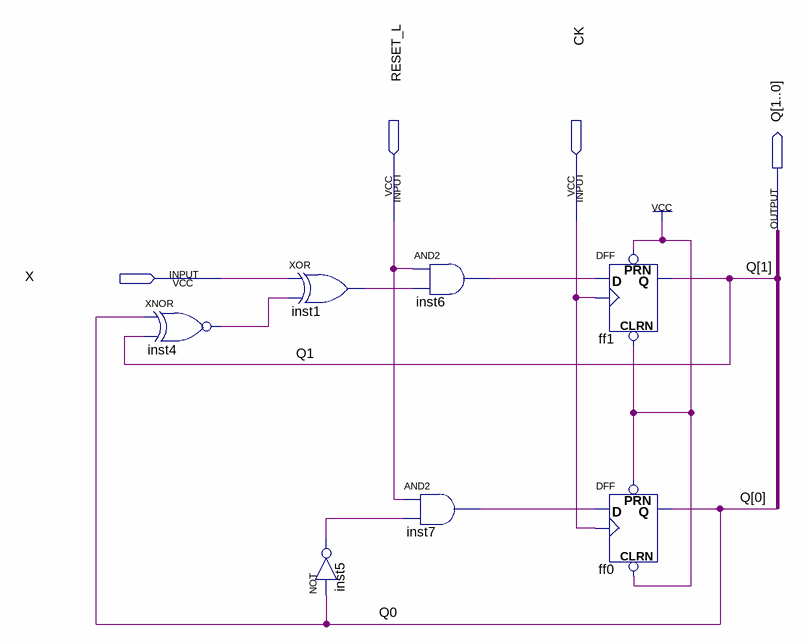
[diagram p0: schematic sheet]
// Quartus schematic MEF.bdf as structural Verilog: 7 symbols, 4 pins
module MEF (
  input  RESET_L,
  input  CK,
  input  X,
  output [1:0] Q
);

  wire inst1_out, inst4_out, inst5_out, inst6_out, inst7_out;

  xnor inst4 (inst4_out, Q[0], Q[1]);
  xor inst1 (inst1_out, X, inst4_out);
  not inst5 (inst5_out, Q[0]);
  and inst6 (inst6_out, RESET_L, inst1_out);
  and inst7 (inst7_out, RESET_L, inst5_out);
  DFF ff1 (.CLRN(1'b1), .CLK(CK), .D(inst6_out), .PRN(1'b1), .Q(Q[1]));
  DFF ff0 (.CLRN(1'b1), .CLK(CK), .D(inst7_out), .PRN(1'b1), .Q(Q[0]));
endmodule
